# Altium schematic sheet ICSL_PS_Combined_STM.SchDoc: SEUS STM32F4
size A; DrawnBy: Stephen Xia; DocumentNumber: 2; Revision: 0.1; SheetNumber: 2; SheetTotal: 3
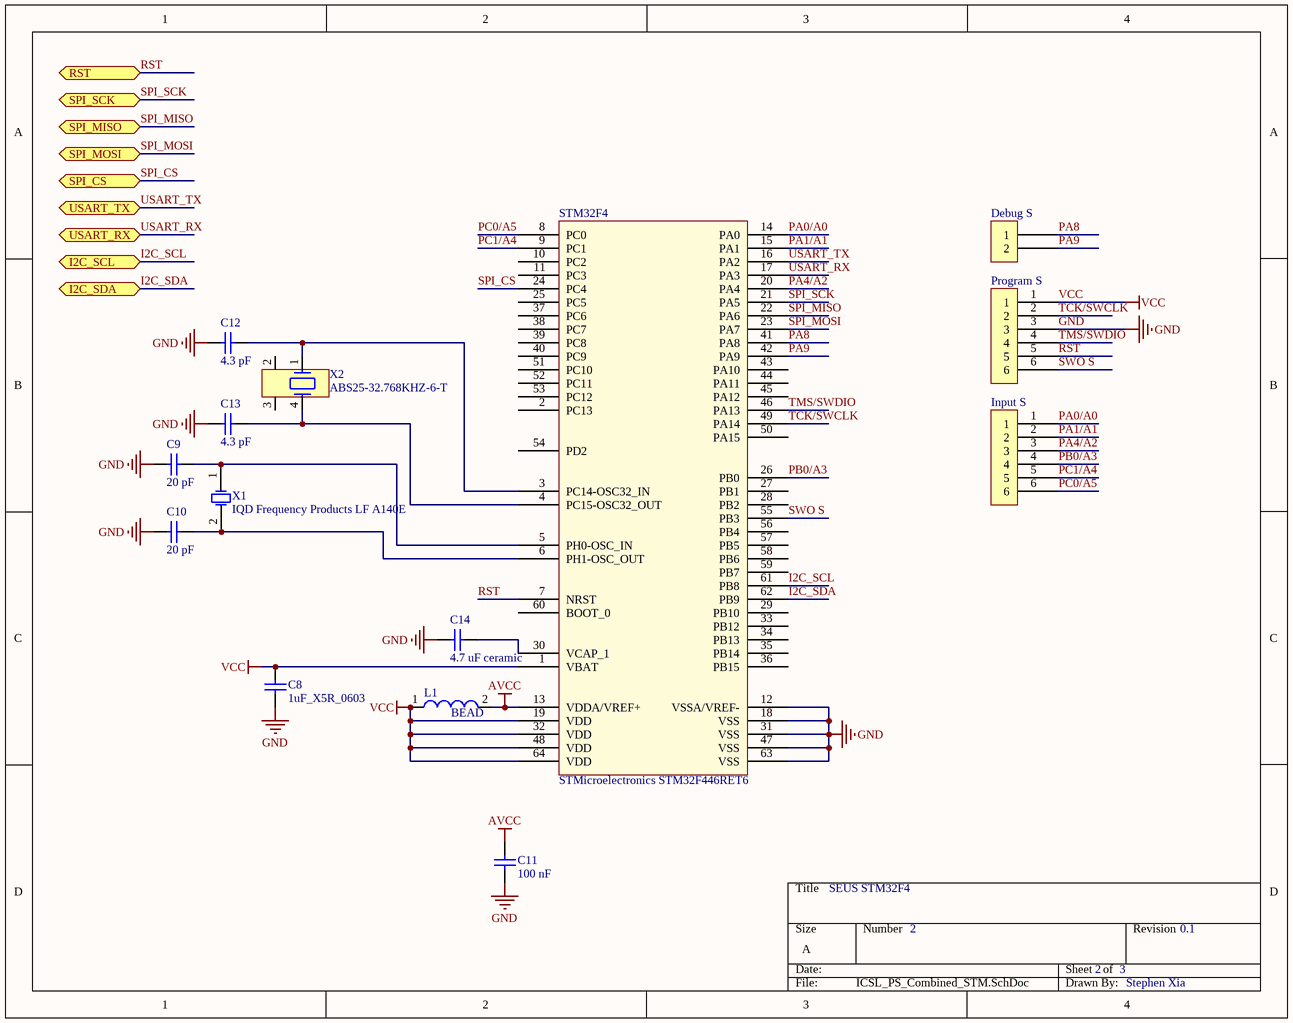
[diagram p0: ICSL_PS_Combined_STM.SchDoc]

## Parts
C8  1uF_X5R_0603  [CAPC1608X87X35LL15T15]
C9  20 pF  [CAPC1608X87X35LL15T15]
C10  20 pF  [CAPC1608X87X35LL15T15]
C11  100 nF  [CAPC1608X87X35LL15T15]
C12  4.3 pF  [CAPC1608X87X35LL15T15]
C13  4.3 pF  [CAPC1608X87X35LL15T15]
C14  4.7 uF ceramic  [CAPC1608X87X35LL15T15]
Debug_S  TE Connectivity / AMP 3-644695-2  [PCB-i8m17woc8q0u0fbeoczf-1]  (value not drawn)
Input_S  TE Connectivity / AMP 5-146281-6  [PCB-ceua2d6kgzjhmbkiz2sm-1]  (value not drawn)
L1  BEAD  [SMD-0402]
Program_S  TE Connectivity / AMP 5-146281-6  [PCB-ceua2d6kgzjhmbkiz2sm-1]  (value not drawn)
STM32F4  STMicroelectronics STM32F446RET6  [TSQFP50P1200X1200X160-64N]
X1  IQD Frequency Products LF A140E  [PCB-dsvehlm98b0q7gmbw6wh-1]
X2  ABS25-32.768KHZ-6-T  [XTAL_4SM_8X3R8]

## Ports
I2C_SCL (bidir), I2C_SDA (bidir), RST (bidir), SPI_CS (bidir), SPI_MISO (bidir), SPI_MOSI (bidir), SPI_SCK (bidir), USART_RX (bidir), USART_TX (bidir)

## Nets
AVCC: C11.2 L1.2 STM32F4.13(VDDA/VREF+)
GND: C8.1 C9.2 C10.2 C11.1 C12.2 C13.2 C14.2 Program_S.3 STM32F4.12(VSSA/VREF-) STM32F4.18(VSS) STM32F4.31(VSS) STM32F4.47(VSS) STM32F4.63(VSS)
VCC: C8.2 L1.1 Program_S.1 STM32F4.1(VBAT) STM32F4.19(VDD) STM32F4.32(VDD) STM32F4.48(VDD) STM32F4.64(VDD)
I2C_SCL: STM32F4.61(PB8) ; port I2C_SCL
I2C_SDA: STM32F4.62(PB9) ; port I2C_SDA
PA0/A0: Input_S.1 STM32F4.14(PA0)
PA1/A1: Input_S.2 STM32F4.15(PA1)
PA4/A2: Input_S.3 STM32F4.20(PA4)
PA8: Debug_S.1 STM32F4.41(PA8)
PA9: Debug_S.2 STM32F4.42(PA9)
PB0/A3: Input_S.4 STM32F4.26(PB0)
PC0/A5: Input_S.6 STM32F4.8(PC0)
PC1/A4: Input_S.5 STM32F4.9(PC1)
RST: Program_S.5 STM32F4.7(NRST) ; port RST
SPI_CS: STM32F4.24(PC4) ; port SPI_CS
SPI_MISO: STM32F4.22(PA6) ; port SPI_MISO
SPI_MOSI: STM32F4.23(PA7) ; port SPI_MOSI
SPI_SCK: STM32F4.21(PA5) ; port SPI_SCK
SWO S: Program_S.6 STM32F4.55(PB3)
TCK/SWCLK: Program_S.2 STM32F4.49(PA14)
TMS/SWDIO: Program_S.4 STM32F4.46(PA13)
USART_RX: STM32F4.17(PA3) ; port USART_RX
USART_TX: STM32F4.16(PA2) ; port USART_TX
NetC9_1: C9.1 STM32F4.5(PH0-OSC_IN) X1.1(X1)
NetC10_1: C10.1 STM32F4.6(PH1-OSC_OUT) X1.2(X2)
NetC12_1: C12.1 STM32F4.3(PC14-OSC32_IN) X2.1
NetC13_1: C13.1 STM32F4.4(PC15-OSC32_OUT) X2.4
NetC14_1: C14.1 STM32F4.30(VCAP_1)

Not connected (* = marked no-connect by the designer): STM32F4 2(PC13) 10(PC2) 11(PC3) 25(PC5) 27(PB1) 28(PB2) 29(PB10) 33(PB12) 34(PB13) 35(PB14) 36(PB15) 37(PC6) 38(PC7) 39(PC8) 40(PC9) 43(PA10) 44(PA11) 45(PA12) 50(PA15) 51(PC10) 52(PC11) 53(PC12) 54(PD2) 56(PB4) 57(PB5) 58(PB6) 59(PB7) 60(BOOT_0); X2 2 3

## Library data of the parts
C8 C10-C14 = C0603C823K5RACTU: Multilayer Ceramic Capacitors MLCC - SMD/SMT 50volts 82000pF X7R 10%; Capacitance: 8.2e-08 F; Lead-Free Status: R; Voltage Rating (DC): 50.0 V; Capacitance Tolerance: ±10%; Case/Package: 0603; Dielectric Characteristic: X7R; Dielectric Material: Ceramic; Mounting Style: Surface Mount; Number of Pins: 2; Octopart Url: https://octopart.com/c0603c823k5ractu-kemet-9138604; OctopartID: 386ff1ee6ca5e7a8; Packaging: Cut Tape (CT); REACH SVHC Compliance: No SVHC; RoHS: Compliant
C9 = CMP-153056-3: Multilayer Ceramic Capacitors MLCC - SMD/SMT 50volts 82000pF X7R 10%; Capacitance: 8.2e-08 F; Lead-Free Status: R; Voltage Rating (DC): 50.0 V; Capacitance Tolerance: ±10%; Case/Package: 0603; Dielectric Characteristic: X7R; Dielectric Material: Ceramic; Mounting Style: Surface Mount; Number of Pins: 2; Octopart Url: https://octopart.com/c0603c823k5ractu-kemet-9138604; OctopartID: 386ff1ee6ca5e7a8; Packaging: Cut Tape (CT); REACH SVHC Compliance: No SVHC; RoHS: Compliant
Debug_S = 3-644695-2: Connector Unshrouded Header 2 Position 2.54mm Solder Straight Thru-Hole; Voltage Rating (AC): 250 V; Number of Positions: 2; Mounting Angle: 180 °; Lead-Free Status: Lead Free; Shrouded: No; ELV Compliant: Compliant; Gender: Male; Flammability Rating: UL 94 V-0; Number of Rows: 1; Housing Color: Natural; Size-Width: 2.34 mm; Mounting Style: Through Hole; Orientation: Vertical; Lifecycle Status: Active; Manufacturer Part Number: 3-644695-2; OctopartID: 2792ecc2f21af855; RoHS: Compliant; Pin Pitch: 2.54 mm; Contact Plating: Tin; Housing Material: Polyester; Size-Length: 4.80 mm; Contact Material: Copper Alloy; Size-Height: 2.54 mm; Number of Contacts: 2; Packaging: Box, Bag; Octopart URL: http://octopart.com/3-644695-2-te+connectivity+%2F+amp-39514350
Input_S Program_S = 5-146281-2: Header; Breakaway; 0.100 in.; PC Board; Single; 6; 0.025 in.; 0.12 in.; 3 A; Gender: Male; Number of Contacts: 6; Lead-Free Status: Lead Free; ELV Compliant: Compliant; Lifecycle Status: Active; OctopartID: 4f28847cfb2a90ef; Manufacturer Part Number: 5-146281-2; Housing Color: Black; Flammability Rating: UL 94 V-0; Orientation: Vertical; Octopart URL: https://octopart.com/5-146281-6-te+connectivity+%2F+amp-40753677; Contact Plating: Tin, Tin over Nickel, Gold; Contact Material: Copper Alloy; RoHS: Compliant; Mounting Style: PCB
L1 = 7427927281: SMD EMI Suppression Ferrite Bead WE-CBF, Z = 800 Ohm; Octopart Url: https://octopart.com/7427927281-w%C3%BCrth+elektronik-19122444; OctopartID: 8f2c4705634650eb; Packaging: Cut Tape (CT); REACH SVHC Compliance: No SVHC; RoHS: Compliant
STM32F4 = STM32F446RET6: MCU 32-bit STM32 ARM Cortex M4 RISC 512KB Flash 2.5V/3.3V Medical 64-Pin LQFP Tray; Clock Speed: 180 MHz; RAM Memory Size: 131072 B; Manufacturer Part Number: STM32F446RET6; RoHS: Compliant; OctopartID: ef3b25128e3530fc; Lifecycle Status: Active; Octopart URL: http://octopart.com/stm32f446ret6-stmicroelectronics-52642920; Mounting Style: Surface Mount; Number of Pins: 64
X1 = LF A140E: Crystal, Smd, 8mhz; Load Capacitance: 16.0 pF; Frequency: 8.00 MHz; Octopart URL: http://octopart.com/lf+a140e-iqd+frequency+products-9229850; Mounting Style: Surface Mount; OctopartID: 3d05f483ce79e2c2; Number of Pins: 2
X2 = ABS25-32.768KHZ-6-T: ABS25 Series 32.768 kHz ±20 ppm 6 pF -40 to +85 °C SMT Low Frequency Crystal; Frequency: 32.8 kHz; Equivalent Series Resistance (ESR): 50.0 kΩ; Lead-Free Status: Lead Free; Load Capacitance: 6.00 pF; REACH SVHC Compliance: No SVHC; Mounting Style: Surface Mount; Seller Landing  Url: https://octopart-clicks.com/click/track?country=US&ak=8157f166&sig=0e47fd3&sid=1106&ppid=9289409&vpid=78496461&ct=offers; OctopartID: a1e368643a447e24; Octopart Url: http://octopart.com/abs25-32.768khz-6-t-abracon-9289409; Manufacturer Part Number: ABS25-32.768KHZ-6-T; RoHS: Compliant; Number of Pins: 4; Packaging: Cut Tape (CT)